# Altium schematic sheet DEBUG_AND_GPIO.SchDoc
size A3; SheetNumber: 5; SheetTotal: 20
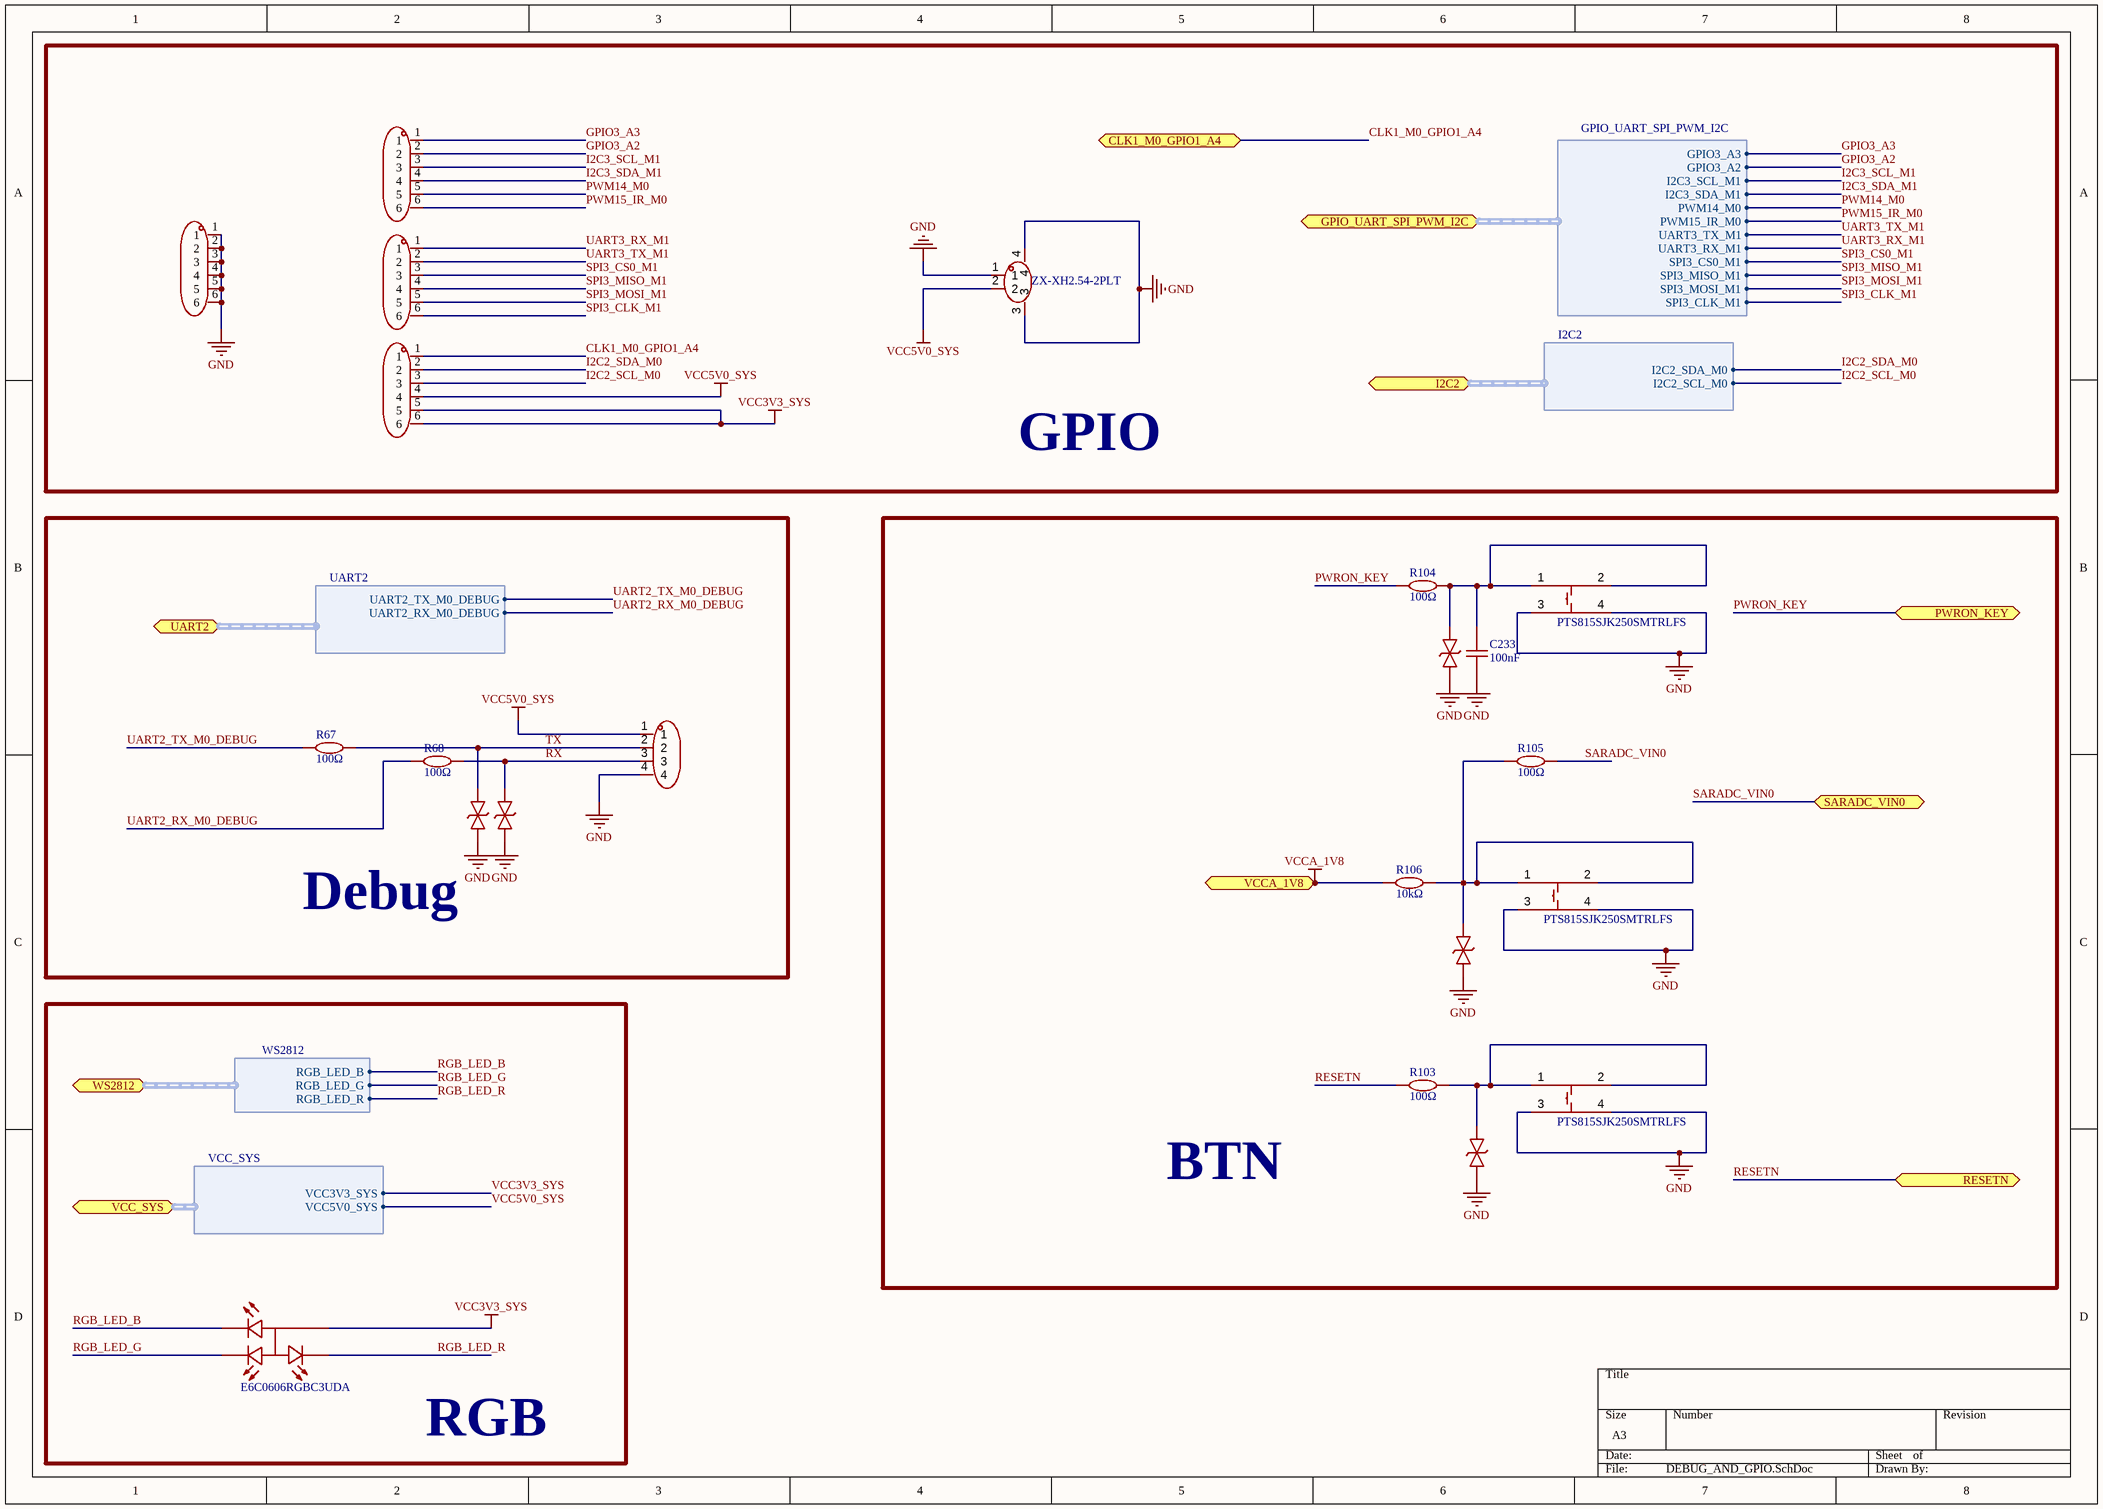
[diagram p0: DEBUG_AND_GPIO.SchDoc]

## Parts
C233  100nF  [C0402]
H1  4  [HDR-TH_4P-P2.54-V-M]  (value not drawn)
LED2  E6C0606RGBC3UDA  [LED-ARRAY-SMD_4P-L1.6-W1.6_SY-PB2333RGBC-010F]
R67  100Ω  [R0402]
R68  100Ω  [R0402]
R103  100Ω  [R0402]
R104  100Ω  [R0402]
R105  100Ω  [R0402]
R106  10kΩ  [R0402]
SW1  PTS815SJK250SMTRLFS  [SW-SMD_4P-L4.2-W3.3-P2.15-LS5.1]
SW2  PTS815SJK250SMTRLFS  [SW-SMD_4P-L4.2-W3.3-P2.15-LS5.1]
SW3  PTS815SJK250SMTRLFS  [SW-SMD_4P-L4.2-W3.3-P2.15-LS5.1]
U27  ZX-XH2.54-2PLT  [CONN-SMD_2P-P2.50_HCTL_HC-XH-2ALT]
U35  ESD5451N  [DFN1006-2L-BI]  (value not drawn)
U36  ESD5451N  [DFN1006-2L-BI]  (value not drawn)
U37  ESD5451N  [DFN1006-2L-BI]  (value not drawn)
U38  HX PZ2.54-1x6P ZZ  [HDR-TH_6P-P2.54-V-M]  (value not drawn)
U39  HX PZ2.54-1x6P ZZ  [HDR-TH_6P-P2.54-V-M]  (value not drawn)
U40  HX PZ2.54-1x6P ZZ  [HDR-TH_6P-P2.54-V-M]  (value not drawn)
U42  ESD5451N  [DFN1006-2L-BI]  (value not drawn)
U43  ESD5451N  [DFN1006-2L-BI]  (value not drawn)
U44  HX PZ2.54-1x6P ZZ  [HDR-TH_6P-P2.54-V-M]  (value not drawn)

## Blocks framed on the sheet
GPIO: U27 U38-U40 U44
Debug: H1 R67 R68 U42 U43
BTN: C233 R103-R106 SW1-SW3 U35-U37
RGB: LED2

## Ports
CLK1_M0_GPIO1_A4 (bidir, see Overview[2D], RK3566[3B], RK3566_FLASH_SD_SARADC[7C]), GPIO_UART_SPI_PWM_I2C (bidir, harness GPIO_UART_SPI_PWM_I2C, see Overview[2D], RK3566[3C], RK3566_USB_GPIO[6D]), I2C2 (bidir, harness I2C2, see Overview[2D], RK3566[3C], RK3566_OSC_PLL_PMUO1_2[5A]), PWRON_KEY (bidir, see Overview[2D], POWER[1C], POWER_PMIC[7A]), RESETN (bidir, see Overview[2D], POWER[1C], POWER_PMIC[7A], RK3566[3C], RK3566_OSC_PLL_PMUO1_2[2B]), SARADC_VIN0 (bidir, see Overview[2D], RK3566[3C], RK3566_USB_GPIO[7A]), UART2 (bidir, harness UART2, see Overview[2D], RK3566[3D], RK3566_OSC_PLL_PMUO1_2[5A]), VCC_SYS (bidir, harness VCC_SYS, see Overview[2D], Audio_AND_HPJ[3A], HDMI[2C], MIPI_DSI_TP[6A], POWER[3B], POWER[6B], POWER_EXTENSION[4D], POWER_FLASH_POWER_MANAGE[3C], POWER_PMIC[6D], Wi-Fi_BT[3D]), VCCA_1V8 (bidir, see Overview[2D], POWER[1C], POWER_PMIC[7A], RK3566[3C], RK3566_USB_GPIO[6C]), WS2812 (bidir, harness WS2812, see Overview[2D], RK3566[3B], RK3566_FLASH_SD_SARADC[6D])

## Harnesses
UART2: UART2_RX_M0_DEBUG, UART2_TX_M0_DEBUG
WS2812: RGB_LED_B, RGB_LED_G, RGB_LED_R
VCC_SYS: VCC3V3_SYS, VCC5V0_SYS
GPIO_UART_SPI_PWM_I2C: I2C3_SDA_M1, PWM14_M0, PWM15_IR_M0, I2C3_SCL_M1, GPIO3_A2, UART3_TX_M1, SPI3_CS0_M1, UART3_RX_M1, SPI3_MISO_M1, SPI3_MOSI_M1, SPI3_CLK_M1, GPIO3_A3
I2C2: I2C2_SDA_M0, I2C2_SCL_M0

## Nets
GND: C233.1 H1.4 SW1.3 SW1.4 SW2.3 SW2.4 SW3.3 SW3.4 U27.1 U27.3 U27.4 U35.1 U36.1 U37.1 U42.1 U43.1 U44.1 U44.2 U44.3 U44.4 U44.5 U44.6
VCC3V3_SYS: LED2.2(+) U40.5 U40.6 ; port VCC_SYS.VCC3V3_SYS
VCC5V0_SYS: H1.1 U27.2 U40.4 ; port VCC_SYS.VCC5V0_SYS
VCCA_1V8: R106.1 ; port VCCA_1V8
CLK1_M0_GPIO1_A4: U40.1 ; port CLK1_M0_GPIO1_A4
GPIO3_A2: U38.2 ; port GPIO_UART_SPI_PWM_I2C.GPIO3_A2
GPIO3_A3: U38.1 ; port GPIO_UART_SPI_PWM_I2C.GPIO3_A3
I2C2_SCL_M0: U40.3 ; port I2C2.I2C2_SCL_M0
I2C2_SDA_M0: U40.2 ; port I2C2.I2C2_SDA_M0
I2C3_SCL_M1: U38.3 ; port GPIO_UART_SPI_PWM_I2C.I2C3_SCL_M1
I2C3_SDA_M1: U38.4 ; port GPIO_UART_SPI_PWM_I2C.I2C3_SDA_M1
PWM14_M0: U38.5 ; port GPIO_UART_SPI_PWM_I2C.PWM14_M0
PWM15_IR_M0: U38.6 ; port GPIO_UART_SPI_PWM_I2C.PWM15_IR_M0
PWRON_KEY: R104.1 ; port PWRON_KEY
RESETN: R103.1 ; port RESETN
RGB_LED_B: LED2.1(-) ; port WS2812.RGB_LED_B
RGB_LED_G: LED2.3(-) ; port WS2812.RGB_LED_G
RGB_LED_R: LED2.4(-) ; port WS2812.RGB_LED_R
RX: H1.3 R68.2 U43.2
SARADC_VIN0: R105.2 ; port SARADC_VIN0
SPI3_CLK_M1: U39.6 ; port GPIO_UART_SPI_PWM_I2C.SPI3_CLK_M1
SPI3_CS0_M1: U39.3 ; port GPIO_UART_SPI_PWM_I2C.SPI3_CS0_M1
SPI3_MISO_M1: U39.4 ; port GPIO_UART_SPI_PWM_I2C.SPI3_MISO_M1
SPI3_MOSI_M1: U39.5 ; port GPIO_UART_SPI_PWM_I2C.SPI3_MOSI_M1
TX: H1.2 R67.2 U42.2
UART2_RX_M0_DEBUG: R68.1 ; port UART2.UART2_RX_M0_DEBUG
UART2_TX_M0_DEBUG: R67.1 ; port UART2.UART2_TX_M0_DEBUG
UART3_RX_M1: U39.1 ; port GPIO_UART_SPI_PWM_I2C.UART3_RX_M1
UART3_TX_M1: U39.2 ; port GPIO_UART_SPI_PWM_I2C.UART3_TX_M1
NetC233_2: C233.2 R104.2 SW2.1 SW2.2 U36.2
NetR103_2: R103.2 SW1.1 SW1.2 U35.2
NetR105_1: R105.1 R106.2 SW3.1 SW3.2 U37.2

## Library data of the parts
C233 = 100nF: 50V 100nF X7R ±10% 0402 Ceramic Capacitors ROHS
H1 = HX PZ2.54-1x4P ZZ: 4P 1x4P Gold Brass -40℃~+105℃ Black Pin Header 2.54mm 2.5mm 6mm 1kV 3mm 3A 1 Through Hole Through Hole,P=2.54mm Headers, Male Pins ROHS; Manufacturer: hanxia(韩下); Symbol: HX PZ2.54-1X3P ZZ; Add into BOM: yes; Pin Structure: 1x3P; Device: HX PZ2.54-1x3P ZZ; LCSC Part Name: 1x3P 间距:2.54mm 方针 直插; Supplier Part: C32713269; Manufacturer Part: HX PZ2.54-1x3P ZZ; Supplier Footprint: 插件,P=2.54mm; JLCPCB Part Class: Extended Part; Datasheet: https://item.szlcsc.com/datasheet/HX%2520PZ2.54-1x3P%2520ZZ/34444549.html; Supplier: LCSC; Convert to PCB: yes; Pitch: 2.54mm; Row Spacing: -; Circluar Pins/Square Pins: Pin Header; Mounting Type: Through Hole; Number of Rows: 1; Number of Pins: 3P; Current Rating: 3A; Voltage Rating (Max): 1kV; Length of Mating Pin: 6mm; Insulation Height: 2.5mm; Length of End Connection Pin: 3mm; Contact Material: Brass; Contact Plating: Gold; Operating Temperature: -40℃~+105℃; Color: Black; Supplementary Features: -
LED2 = E6C0606RGBC3UDA: RGB三色 SMD-4P,1.6x1.6mm; Symbol: E6C0606RGBC3UDA
R67 R68 R103-R105 = 100Ω: 100Ω 62.5mW 50V ±100ppm/℃ Thick Film Resistor ±1% 0402 Chip Resistor - Surface Mount ROHS
R106 = 10kΩ: 62.5mW 10kΩ 50V ±100ppm/℃ Thick Film Resistor ±1% 0402 Chip Resistor - Surface Mount ROHS
SW1-SW3 = PTS815SJK250SMTRLFS: 4pin 轻触开关 SMD​; Symbol: PTS815SJK250SMTRLFS
U27 = ZX-XH2.54-2PLT: ;SMD,P=2.5mm;SMD,P=2.54mm; Symbol: ZX-XH2.54-2PLT
U35-U37 U42 U43 = ESD5451N_C5261080: 9A 9.8V 8V Bidirectional 5V DFN1006-2L TVS Diodes ROHS; Manufacturer: HXY MOSFET(华轩阳电子); Add into BOM: yes; Reverse Leakage Current (Ir): 500nA; Number of Channels: 1.0; level of protection: IEC 61000-4-2; Junction Capacitance: 15pF; Symbol: ESD5451N_C5261080; Device: ESD5451N_C5261080; LCSC Part Name: 5V 15pF 双向; Supplier Part: C5261080; Manufacturer Part: ESD5451N; Supplier Footprint: DFN1006-2L; JLCPCB Part Class: Extended Part; Datasheet: https://item.szlcsc.com/datasheet/ESD5451N/5983779.html; Supplier: LCSC; Convert to PCB: yes; Polarity: Bidirectional; Reverse Stand-Off Voltage (Vrwm): 5V; Clamping Voltage: 9.8V; Peak Pulse Current (Ipp): 9A; Voltage - Breakdown: 8V; Type: ESD
U38-U40 U44 = HX PZ2.54-1x6P ZZ: 6P 1x6P Gold Brass -40℃~+105℃ Black Pin Header 2.54mm 2.5mm 6mm 1kV 3mm 3A 1 Through Hole Through Hole,P=2.54mm Headers, Male Pins ROHS; Manufacturer: hanxia(韩下); Add into BOM: yes; Symbol: HX PZ2.54-1X6P ZZ; Device: HX PZ2.54-1x6P ZZ; LCSC Part Name: 1x6P 间距:2.54mm 方针 直插; Supplier Part: C32713272; Manufacturer Part: HX PZ2.54-1x6P ZZ; Supplier Footprint: 插件,P=2.54mm; JLCPCB Part Class: Extended Part; Datasheet: https://item.szlcsc.com/datasheet/HX%2520PZ2.54-1x6P%2520ZZ/34444552.html; Supplier: LCSC; Convert to PCB: yes; Pin Structure: 1x6P; Pitch: 2.54mm; Row Spacing: -; Circluar Pins/Square Pins: Pin Header; Mounting Type: Through Hole; Number of Rows: 1; Number of Pins: 6P; Current Rating: 3A; Voltage Rating (Max): 1kV; Length of Mating Pin: 6mm; Insulation Height: 2.5mm; Length of End Connection Pin: 3mm; Contact Material: Brass; Contact Plating: Gold; Operating Temperature: -40℃~+105℃; Color: Black; Supplementary Features: -